# Altium schematic sheet MSP-EXP430F5529LP_0.SchDoc: MSP-EXP430F5529LP
size 286 x 199 mm; Date: 2015/6/22 13:08:34; SheetNumber: 1; Origin: Eagle; GateName_1: G$1; SymbolName_1: DINA4_L; LibraryName: MSP-EXP430F5659; DeviceSetName: DINA4_L; GateName_2: G$2; SymbolName_2: DOCFIELD; Sheet: Sheet:; REV: REV:
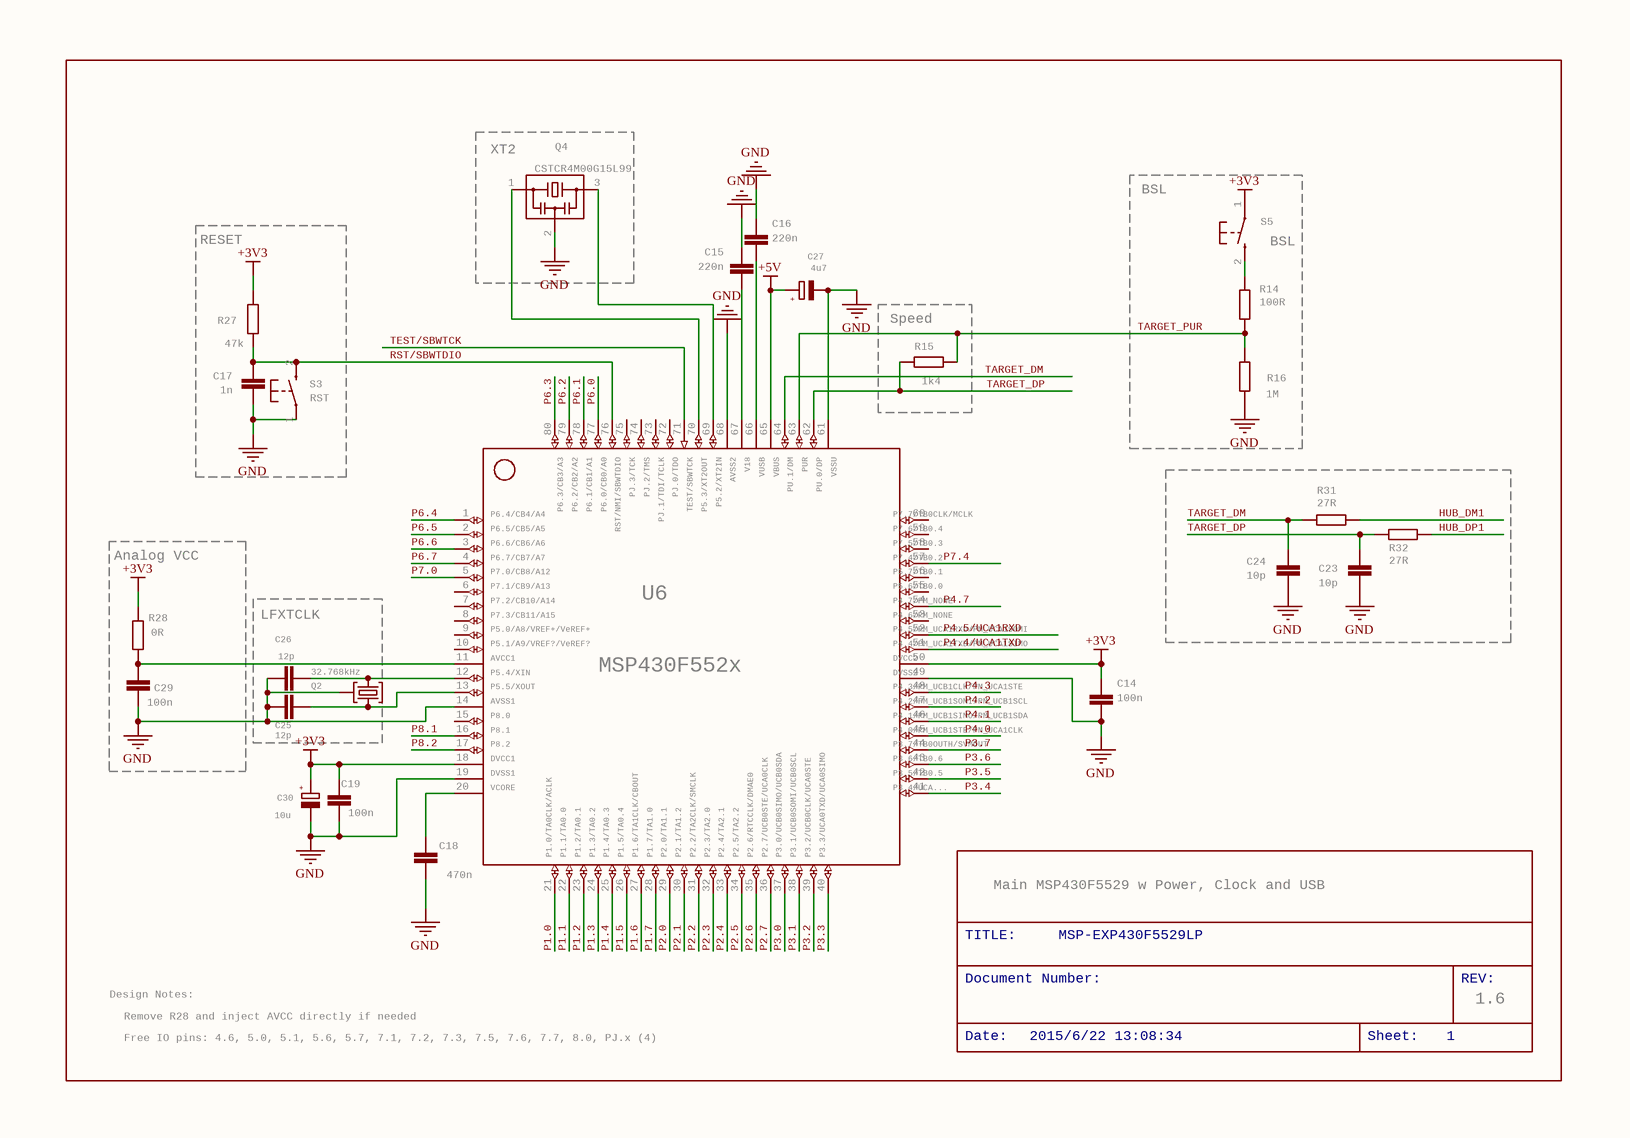
[diagram p0: MSP-EXP430F5529LP_0.SchDoc]

## Parts
C14  100n  [0402]
C15  220n  [0402]
C16  220n  [0402]
C17  1n  [0402]
C18  470n  [0402]
C19  100n  [0402]
C23  10p  [0402]
C24  10p  [0402]
C25  12p  [0402]
C26  12p  [0402]
C27  4u7  [A/3216-18R]
C29  100n  [0402]
C30  10u  [A/3216-18R]
Q2  32.768kHz  [MS3V-T1R]
Q4  CSTCR4M00G15L99  [MURATA-FILTER_CSTCR]
R14  100R  [0402]
R15  1k4  [0402]
R16  1M  [0402]
R27  47k  [0402]
R28  0R  [0402]
R31  27R  [0402]
R32  27R  [0402]
S3  RST  [PBTH]
S5  BSL  [PBTH]
U6  MSP430F5529IPNR  [PN80]  (value not drawn)

## Blocks framed on the sheet
XT2: Q4
BSL: R14 R16 S5
RESET: C17 R27 S3
Speed: R15
Analog VCC: C29 R28
LFXTCLK: C25 C26 Q2

## Nets
+3V3: C14.1 C19.2 C30.+ R27.2 R28.2 S5.1(P) U6.18 U6.50
+5V: C27.+ U6.65
GND: C14.2 C15.2 C16.2 C17.2 C18.1 C19.1 C23.2 C24.2 C25.1 C26.1 C27.- C29.2 C30.- Q2.P3(GND) Q4.2 R16.1 S3.1(P) U6.14 U6.19 U6.49 U6.61 U6.68
HUB_DM1: R31.1
HUB_DP1: R32.1
P1.0: U6.21
P1.1: U6.22
P1.2: U6.23
P1.3: U6.24
P1.4: U6.25
P1.5: U6.26
P1.6: U6.27
P1.7: U6.28
P2.0: U6.29
P2.1: U6.30
P2.2: U6.31
P2.3: U6.32
P2.4: U6.33
P2.5: U6.34
P2.6: U6.35
P2.7: U6.36
P3.0: U6.37
P3.1: U6.38
P3.2: U6.39
P3.3: U6.40
P3.4: U6.41
P3.5: U6.42
P3.6: U6.43
P3.7: U6.44
P4.0: U6.45
P4.1: U6.46
P4.2: U6.47
P4.3: U6.48
P4.4/UCA1TXD: U6.51
P4.5/UCA1RXD: U6.52
P4.7: U6.54
P6.0: U6.77
P6.1: U6.78
P6.2: U6.79
P6.3: U6.80
P6.4: U6.1
P6.5: U6.2
P6.6: U6.3
P6.7: U6.4
P7.0: U6.5
P7.4: U6.57
P8.1: U6.16
P8.2: U6.17
RST/SBWTDIO: C17.1 R27.1 S3.2(S) U6.76
TARGET_DM: C24.1 R31.2 U6.64
TARGET_DP: C23.1 R15.2 R32.2 U6.62
TARGET_PUR: R14.2 R15.1 R16.2 U6.63
TEST/SBWTCK: U6.71
NetC15_1: C15.1 U6.67
NetC16_1: C16.1 U6.66
NetC18_2: C18.2 U6.20
NetC25_2: C25.2 Q2.P1 U6.13
NetC26_2: C26.2 Q2.P2 U6.12
NetC29_1: C29.1 R28.1 U6.11
NetQ4_1: Q4.1 U6.70
NetQ4_3: Q4.3 U6.69
NetR14_1: R14.1 S5.2(S)

Not connected (* = marked no-connect by the designer): U6 6 7 8 9 10 15 53 55 56 58 59 60 72 73 74 75

## Notes on the sheet
- TITLE:
- Main MSP430F5529 w Power, Clock and USB
- MSP-EXP430F5529LP
- Design Notes:
- Remove R28 and inject AVCC directly if needed
- Document Number:
- REV:
- 1.6
- Free IO pins: 4.6, 5.0, 5.1, 5.6, 5.7, 7.1, 7.2, 7.3, 7.5, 7.6, 7.7, 8.0, PJ.x (4)
- Date:
- 2015/6/22 13:08:34
- Sheet:
- 1

## Library data of the parts
C14-C19 C23-C26 C29 = C-EUCM0402: CAPACITOR, European symbol; GateName_1: G$1; SymbolName_1: C-EU; DeviceName: CM0402; LibraryName: rcl; DeviceSetName: C-EU
C27 C30 = CPOL-EUA/3216-18R: POLARIZED CAPACITOR, European symbol; GateName_1: G$1; SymbolName_1: CPOL; DeviceName: A/3216-18R; LibraryName: rcl; DeviceSetName: CPOL-EU; +: +
Q2 = MS3V-T1R: GateName_1: >NAME; SymbolName_1: CRYSTAL_W_METALHOUSING; LibraryName: microcrystal; DeviceSetName: MS3V-T1R
Q4 = MURATA-FILTER_CSTCR: Resonator   Source: murata.co.jp; MPN: CSTCR6M00G53-R0; GateName_1: G$1; SymbolName_1: MURATA-FILTER_CST; LibraryName: murata; DeviceSetName: MURATA-FILTER_CSTCR; MF: MF; OC_FARNELL: 1170434; OC_NEWARK: 25M8759
R14-R16 R27 R28 R31 R32 = R-EU_RM0402: RESISTOR, European symbol; GateName_1: G$1; SymbolName_1: R-EU; DeviceName: RM0402; DeviceSetName: R-EU_; LibraryName: rcl
S3 S5 = PB: OMRON SWITCH; GateName_1: G$1; SymbolName_1: PB; LibraryName: electricalmeter; DeviceSetName: PB
U6 = F552X---PN80: ***MSP430F552X***PN80 http://www.ti.com/lit/gpn/msp430f5529 Rev1.0 06/2010    For F552X where X is 1,5,7,9; GateName_1: G$1; SymbolName_1: F552X---PN80; LibraryName: TI_MSP430_v16_intern; DeviceSetName: F552X---PN80; P6.3/CB3/A3: P6.3/CB3/A3; P6.2/CB2/A2: P6.2/CB2/A2; P6.1/CB1/A1: P6.1/CB1/A1; P6.0/CB0/A0: P6.0/CB0/A0; PJ.3/TCK: PJ.3/TCK; PJ.2/TMS: PJ.2/TMS; PJ.1/TDI/TCLK: PJ.1/TDI/TCLK; PJ.0/TDO: PJ.0/TDO; TEST/SBWTCK: TEST/SBWTCK; P5.3/XT2OUT: P5.3/XT2OUT; P5.2/XT2IN: P5.2/XT2IN; AVSS2: AVSS2; V18: V18; VUSB: VUSB; VBUS: VBUS; PU.1/DM: PU.1/DM; PUR: PUR; PU.0/DP: PU.0/DP; VSSU: VSSU; RST/NMI/SBWTDIO: RST/NMI/SBWTDIO; P7.7/TB0CLK/MCLK: P7.7/TB0CLK/MCLK; P7.6/TB0.4: P7.6/TB0.4; P7.5/TB0.3: P7.5/TB0.3; P7.4/TB0.2: P7.4/TB0.2; P5.7/TB0.1: P5.7/TB0.1; P5.6/TB0.0: P5.6/TB0.0; P4.7/PM_NONE: P4.7/PM_NONE; P4.5/PM_UCA1RXD/PM_UCA1SOMI: P4.5/PM_UCA1RXD/PM_UCA1SOMI; P4.4/PM_UCA1TXD/PM_UCA1SIMO: P4.4/PM_UCA1TXD/PM_UCA1SIMO; DVCC2: DVCC2; P4.3/PM_UCB1CLK/PM_UCA1STE: P4.3/PM_UCB1CLK/PM_UCA1STE; P4.2/PM_UCB1SOMI/PM_UCB1SCL: P4.2/PM_UCB1SOMI/PM_UCB1SCL; P4.1/PM_UCB1SIMO/PM_UCB1SDA: P4.1/PM_UCB1SIMO/PM_UCB1SDA; P4.0/PM_UCB1STE/PM_UCA1CLK: P4.0/PM_UCB1STE/PM_UCA1CLK; P3.7/TB0OUTH/SVMOUT: P3.7/TB0OUTH/SVMOUT; P3.6/TB0.6: P3.6/TB0.6; P4.6/PM_NONE: P4.6/PM_NONE; P3.5/TB0.5: P3.5/TB0.5; P3.4/UCA...: P3.4/UCA...; P1.0/TA0CLK/ACLK: P1.0/TA0CLK/ACLK; P1.1/TA0.0: P1.1/TA0.0; P1.2/TA0.1: P1.2/TA0.1; P1.3/TA0.2: P1.3/TA0.2; P1.4/TA0.3: P1.4/TA0.3; P1.5/TA0.4: P1.5/TA0.4; P1.6/TA1CLK/CBOUT: P1.6/TA1CLK/CBOUT; P1.7/TA1.0: P1.7/TA1.0; P2.0/TA1.1: P2.0/TA1.1; P2.1/TA1.2: P2.1/TA1.2; P2.2/TA2CLK/SMCLK: P2.2/TA2CLK/SMCLK; P2.4/TA2.1: P2.4/TA2.1; P2.5/TA2.2: P2.5/TA2.2; P2.6/RTCCLK/DMAE0: P2.6/RTCCLK/DMAE0; P2.7/UCB0STE/UCA0CLK: P2.7/UCB0STE/UCA0CLK; P3.0/UCB0SIMO/UCB0SDA: P3.0/UCB0SIMO/UCB0SDA; P3.1/UCB0SOMI/UCB0SCL: P3.1/UCB0SOMI/UCB0SCL; P3.2/UCB0CLK/UCA0STE: P3.2/UCB0CLK/UCA0STE; P3.3/UCA0TXD/UCA0SIMO: P3.3/UCA0TXD/UCA0SIMO; P6.4/CB4/A4: P6.4/CB4/A4; P6.5/CB5/A5: P6.5/CB5/A5; P6.6/CB6/A6: P6.6/CB6/A6; P6.7/CB7/A7: P6.7/CB7/A7; P7.0/CB8/A12: P7.0/CB8/A12; P7.1/CB9/A13: P7.1/CB9/A13; P7.2/CB10/A14: P7.2/CB10/A14; P7.3/CB11/A15: P7.3/CB11/A15; P5.0/A8/VREF+/VeREF+: P5.0/A8/VREF+/VeREF+; P5.1/A9/VREF?/VeREF?: P5.1/A9/VREF?/VeREF?; AVCC1: AVCC1; P5.4/XIN: P5.4/XIN; P5.5/XOUT: P5.5/XOUT; AVSS1: AVSS1; P8.0: P8.0; P8.1: P8.1; P8.2: P8.2; DVCC1: DVCC1; DVSS1: DVSS1; VCORE: VCORE; MSP430F552x: MSP430F552x; DVSS2: DVSS2; P2.3/TA2.0: P2.3/TA2.0